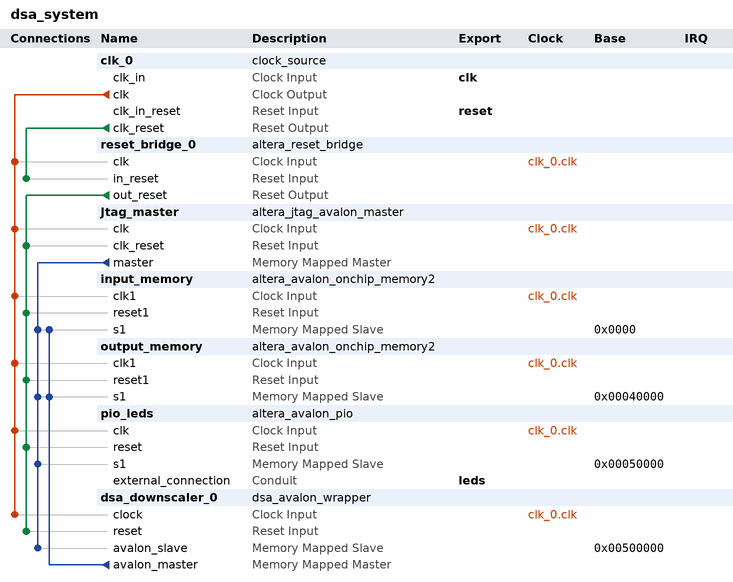
[diagram p0: system contents]
# Platform Designer (Qsys) system dsa_system, Cyclone V 5CSEMA5F31C6
# Parameters at their usual value, and those the tool derives, are not listed.
package require -exact qsys 20.1
create_system dsa_system
set_project_property DEVICE_FAMILY {Cyclone V}
set_project_property DEVICE 5CSEMA5F31C6

add_instance clk_0 clock_source 20.1
set_instance_parameter_value clk_0 clockFrequency 50000000

add_instance reset_bridge_0 altera_reset_bridge 20.1
set_instance_parameter_value reset_bridge_0 ACTIVE_LOW_RESET 0
set_instance_parameter_value reset_bridge_0 SYNCHRONOUS_EDGES deassert

add_instance Jtag_master altera_jtag_avalon_master 20.1

add_instance input_memory altera_avalon_onchip_memory2 20.1
set_instance_parameter_value input_memory allowInSystemMemoryContentEditor true
set_instance_parameter_value input_memory dataWidth 32
set_instance_parameter_value input_memory dualPort false
set_instance_parameter_value input_memory initMemContent false
set_instance_parameter_value input_memory initializationFileName onchip_mem.hex
set_instance_parameter_value input_memory memorySize 262144

add_instance output_memory altera_avalon_onchip_memory2 20.1
set_instance_parameter_value output_memory allowInSystemMemoryContentEditor true
set_instance_parameter_value output_memory dataWidth 32
set_instance_parameter_value output_memory dualPort false
set_instance_parameter_value output_memory initMemContent false
set_instance_parameter_value output_memory initializationFileName onchip_mem.hex
set_instance_parameter_value output_memory memorySize 65536

add_instance pio_leds altera_avalon_pio 20.1
set_instance_parameter_value pio_leds direction Output
set_instance_parameter_value pio_leds width 10

add_instance dsa_downscaler_0 dsa_avalon_wrapper 1.0
set_instance_parameter_value dsa_downscaler_0 N 4

# connections
add_connection clk_0.clk dsa_downscaler_0.clock clock
add_connection clk_0.clk input_memory.clk1 clock
add_connection clk_0.clk Jtag_master.clk clock
add_connection clk_0.clk output_memory.clk1 clock
add_connection clk_0.clk pio_leds.clk clock
add_connection clk_0.clk reset_bridge_0.clk clock
add_connection clk_0.clk_reset reset_bridge_0.in_reset reset
add_connection reset_bridge_0.out_reset dsa_downscaler_0.reset reset
add_connection reset_bridge_0.out_reset input_memory.reset1 reset
add_connection reset_bridge_0.out_reset Jtag_master.clk_reset reset
add_connection reset_bridge_0.out_reset output_memory.reset1 reset
add_connection reset_bridge_0.out_reset pio_leds.reset reset
add_connection dsa_downscaler_0.avalon_master input_memory.s1 avalon
set_connection_parameter_value dsa_downscaler_0.avalon_master/input_memory.s1 baseAddress 0x0000
add_connection dsa_downscaler_0.avalon_master output_memory.s1 avalon
set_connection_parameter_value dsa_downscaler_0.avalon_master/output_memory.s1 baseAddress 0x00040000
add_connection Jtag_master.master dsa_downscaler_0.avalon_slave avalon
set_connection_parameter_value Jtag_master.master/dsa_downscaler_0.avalon_slave baseAddress 0x00500000
add_connection Jtag_master.master input_memory.s1 avalon
set_connection_parameter_value Jtag_master.master/input_memory.s1 baseAddress 0x0000
add_connection Jtag_master.master output_memory.s1 avalon
set_connection_parameter_value Jtag_master.master/output_memory.s1 baseAddress 0x00040000
add_connection Jtag_master.master pio_leds.s1 avalon
set_connection_parameter_value Jtag_master.master/pio_leds.s1 baseAddress 0x00050000

# exported interfaces
add_interface clk clock sink
set_interface_property clk EXPORT_OF clk_0.clk_in
add_interface leds conduit end
set_interface_property leds EXPORT_OF pio_leds.external_connection
add_interface reset reset sink
set_interface_property reset EXPORT_OF clk_0.clk_in_reset

set_interconnect_requirement {$system} qsys_mm.clockCrossingAdapter HANDSHAKE
set_interconnect_requirement {$system} qsys_mm.enableEccProtection FALSE
set_interconnect_requirement {$system} qsys_mm.insertDefaultSlave FALSE
set_interconnect_requirement {$system} qsys_mm.maxAdditionalLatency 1

save_system dsa_system.qsys
